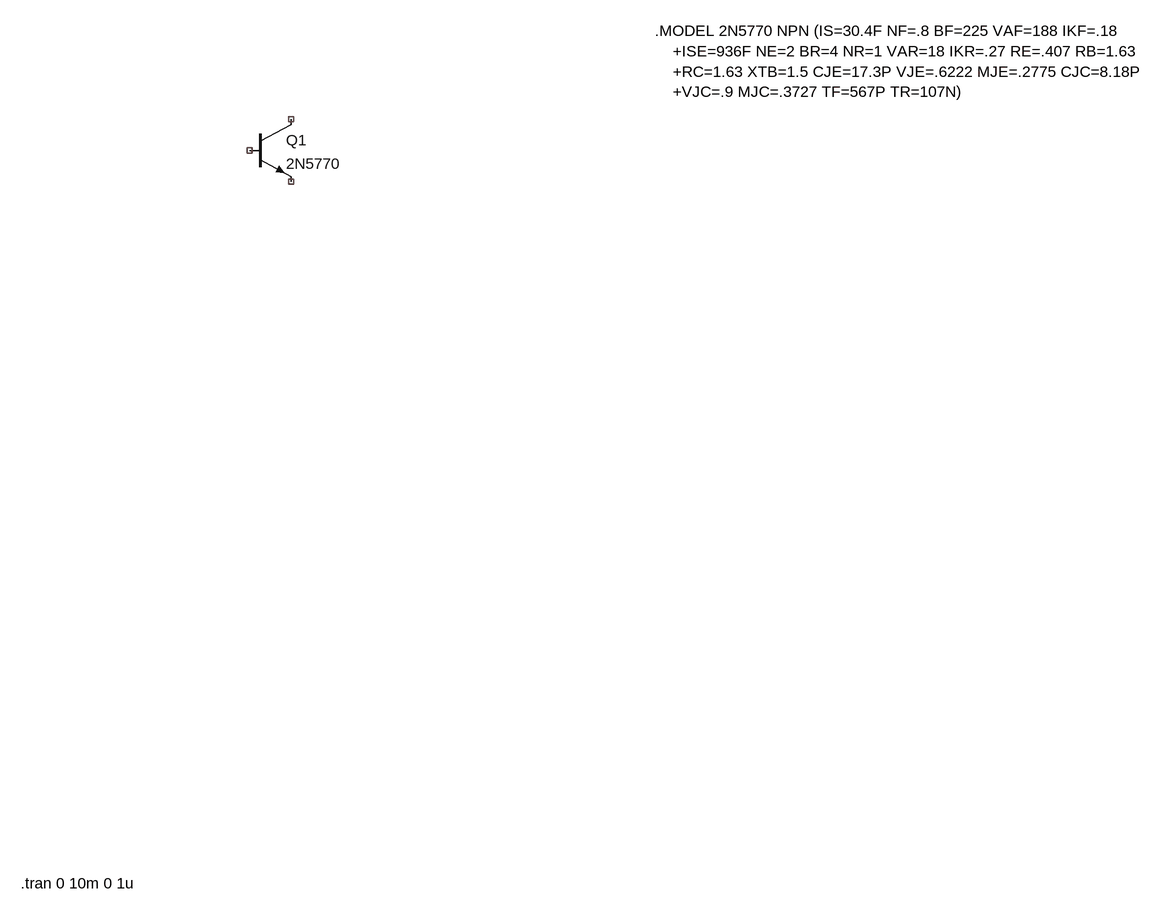
[diagram p0: schematic Draft1.asc]
Draft1.asc, the LTspice schematic file:
Version 4.1
SHEET 1 1240 1400
SYMBOL npn -192 208 R0
SYMATTR InstName Q1
SYMATTR Value 2N5770
TEXT 432 72 Left 2 !.MODEL 2N5770 NPN (IS=30.4F NF=.8 BF=225 VAF=188 IKF=.18\n    +ISE=936F NE=2 BR=4 NR=1 VAR=18 IKR=.27 RE=.407 RB=1.63\n    +RC=1.63 XTB=1.5 CJE=17.3P VJE=.6222 MJE=.2775 CJC=8.18P \n    +VJC=.9 MJC=.3727 TF=567P TR=107N)
TEXT -544 1384 Left 2 !.tran 0 10m 0 1u

The netlist it stands for:
* Draft1.asc
Q1 NC_01 NC_02 NC_03 0 2N5770
.model NPN NPN
.model PNP PNP
.lib standard.bjt
.MODEL 2N5770 NPN (IS=30.4F NF=.8 BF=225 VAF=188 IKF=.18
    +ISE=936F NE=2 BR=4 NR=1 VAR=18 IKR=.27 RE=.407 RB=1.63
    +RC=1.63 XTB=1.5 CJE=17.3P VJE=.6222 MJE=.2775 CJC=8.18P
    +VJC=.9 MJC=.3727 TF=567P TR=107N)
.tran 0 10m 0 1u
.backanno
.end